# EAGLE schematic IRAMX-drv-v3.4 (EAGLE 7.7.0)
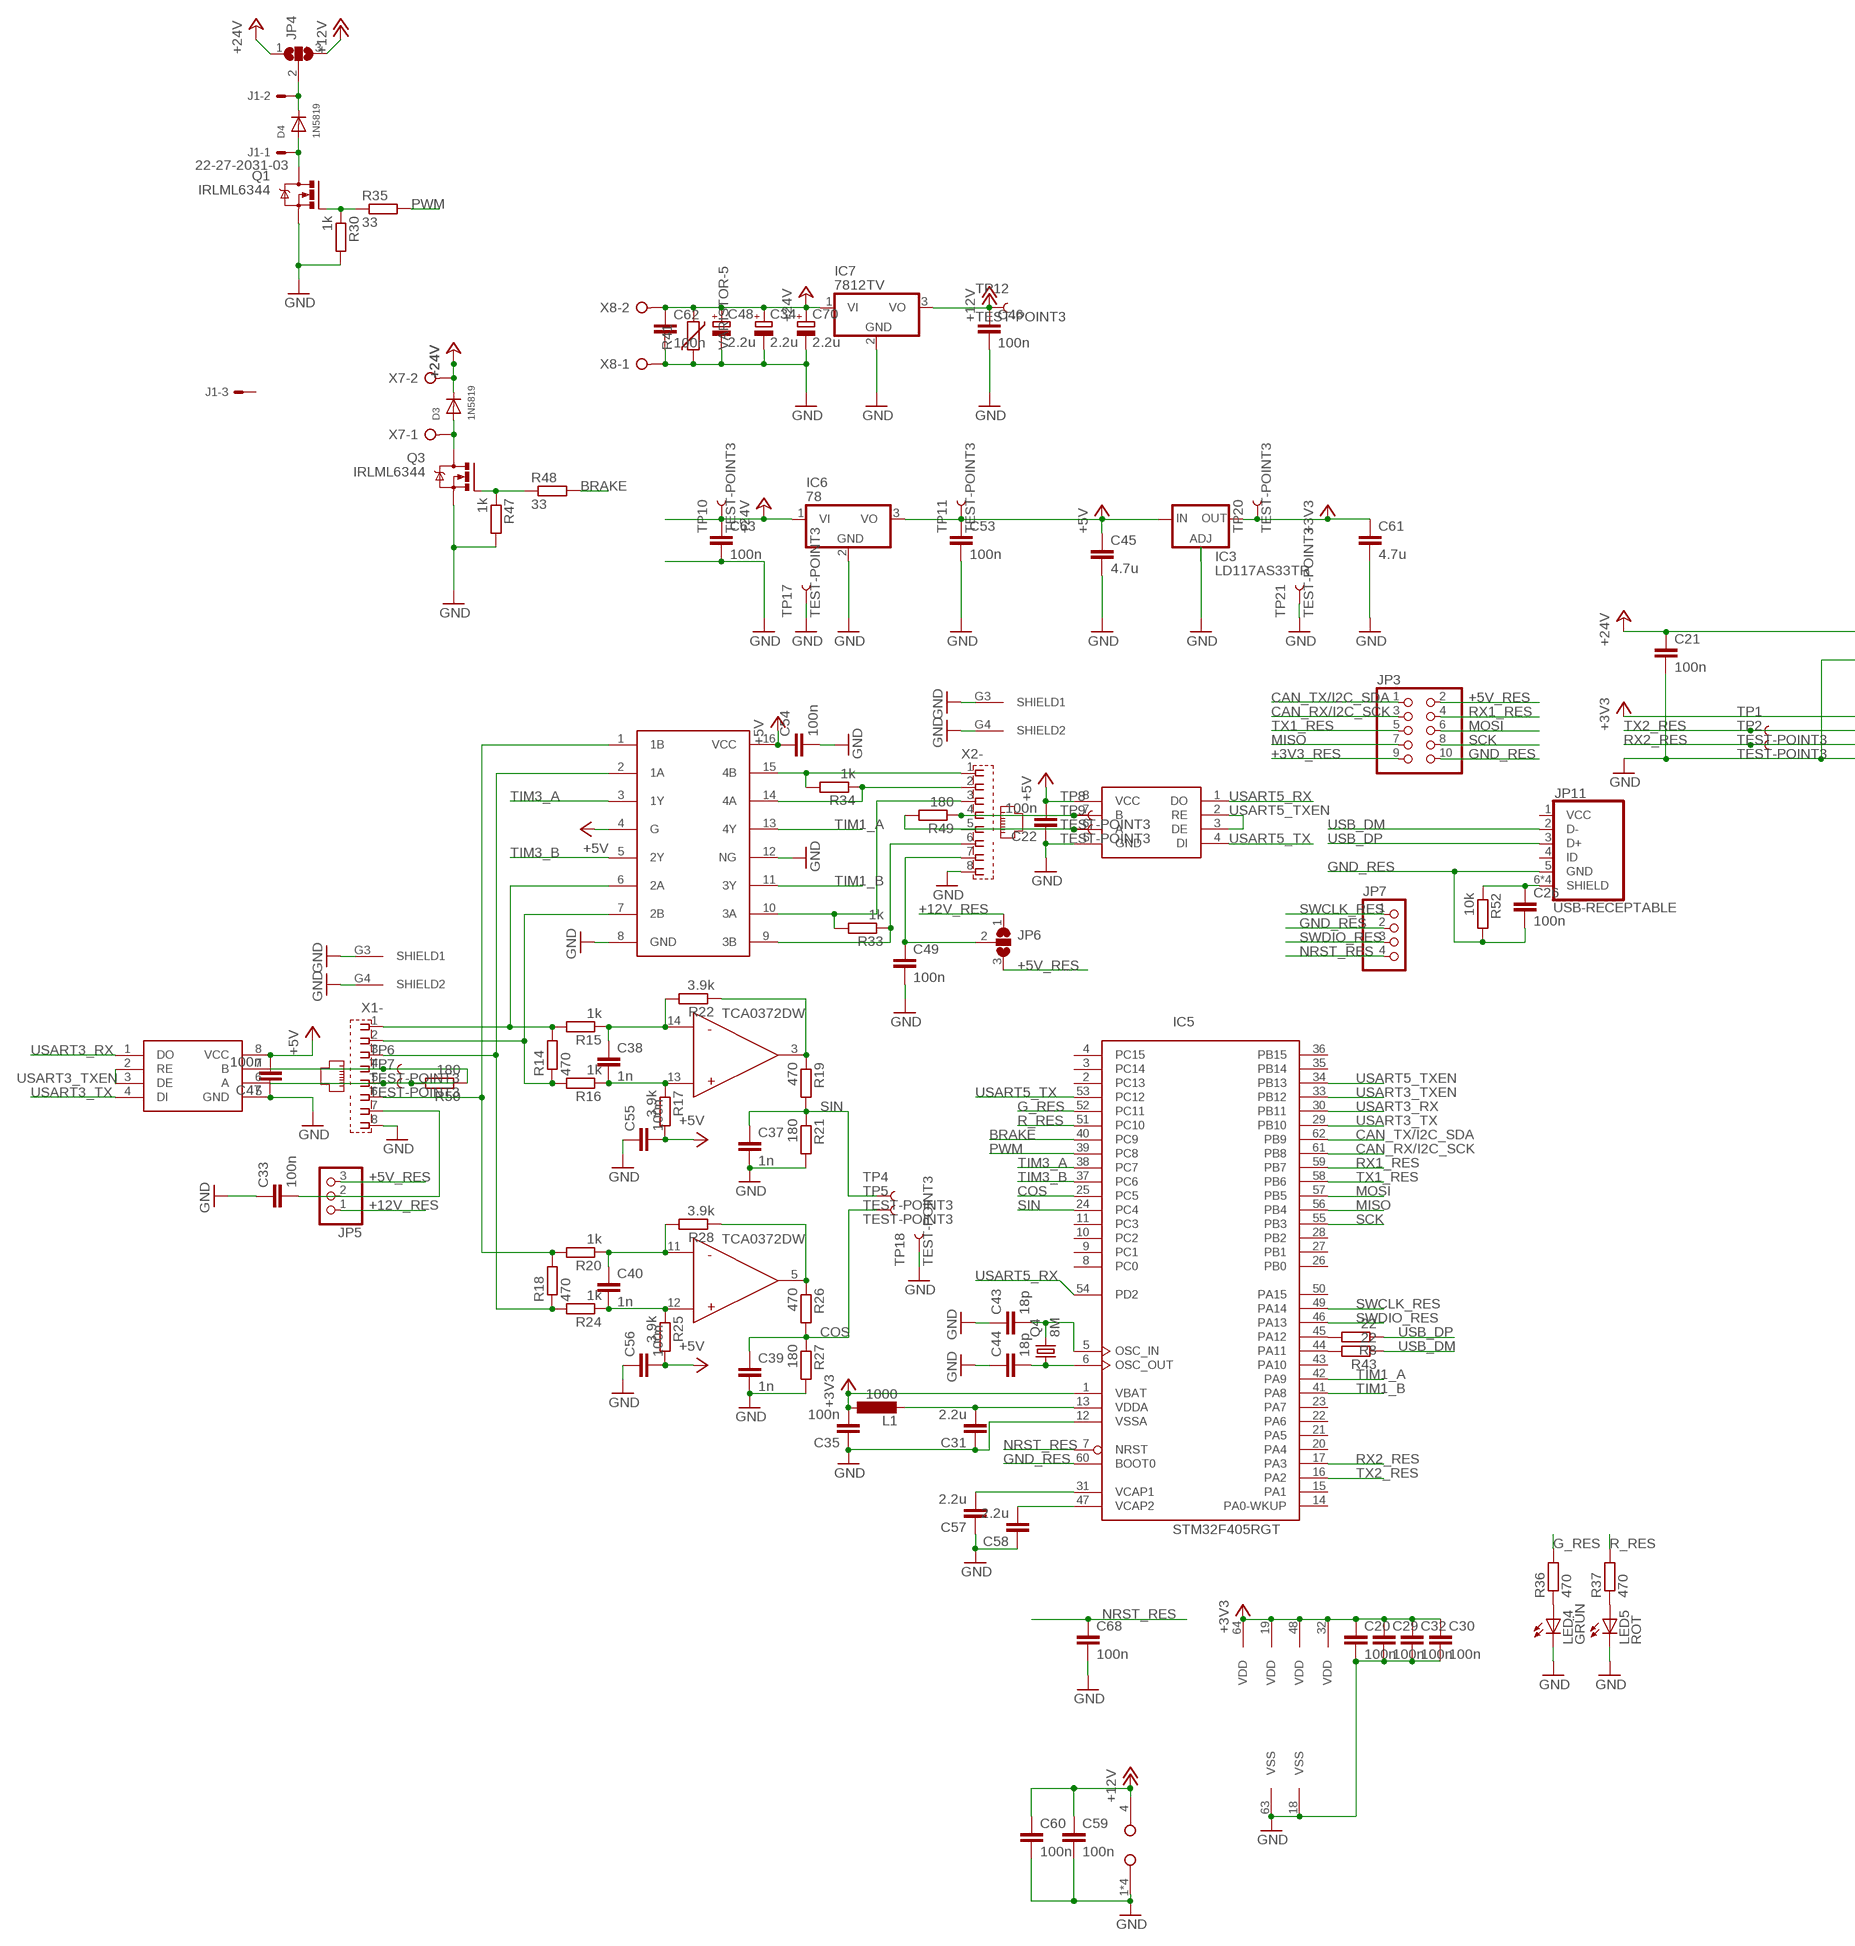
[diagram p0: schematic, sheet 1, part 1 of 2]
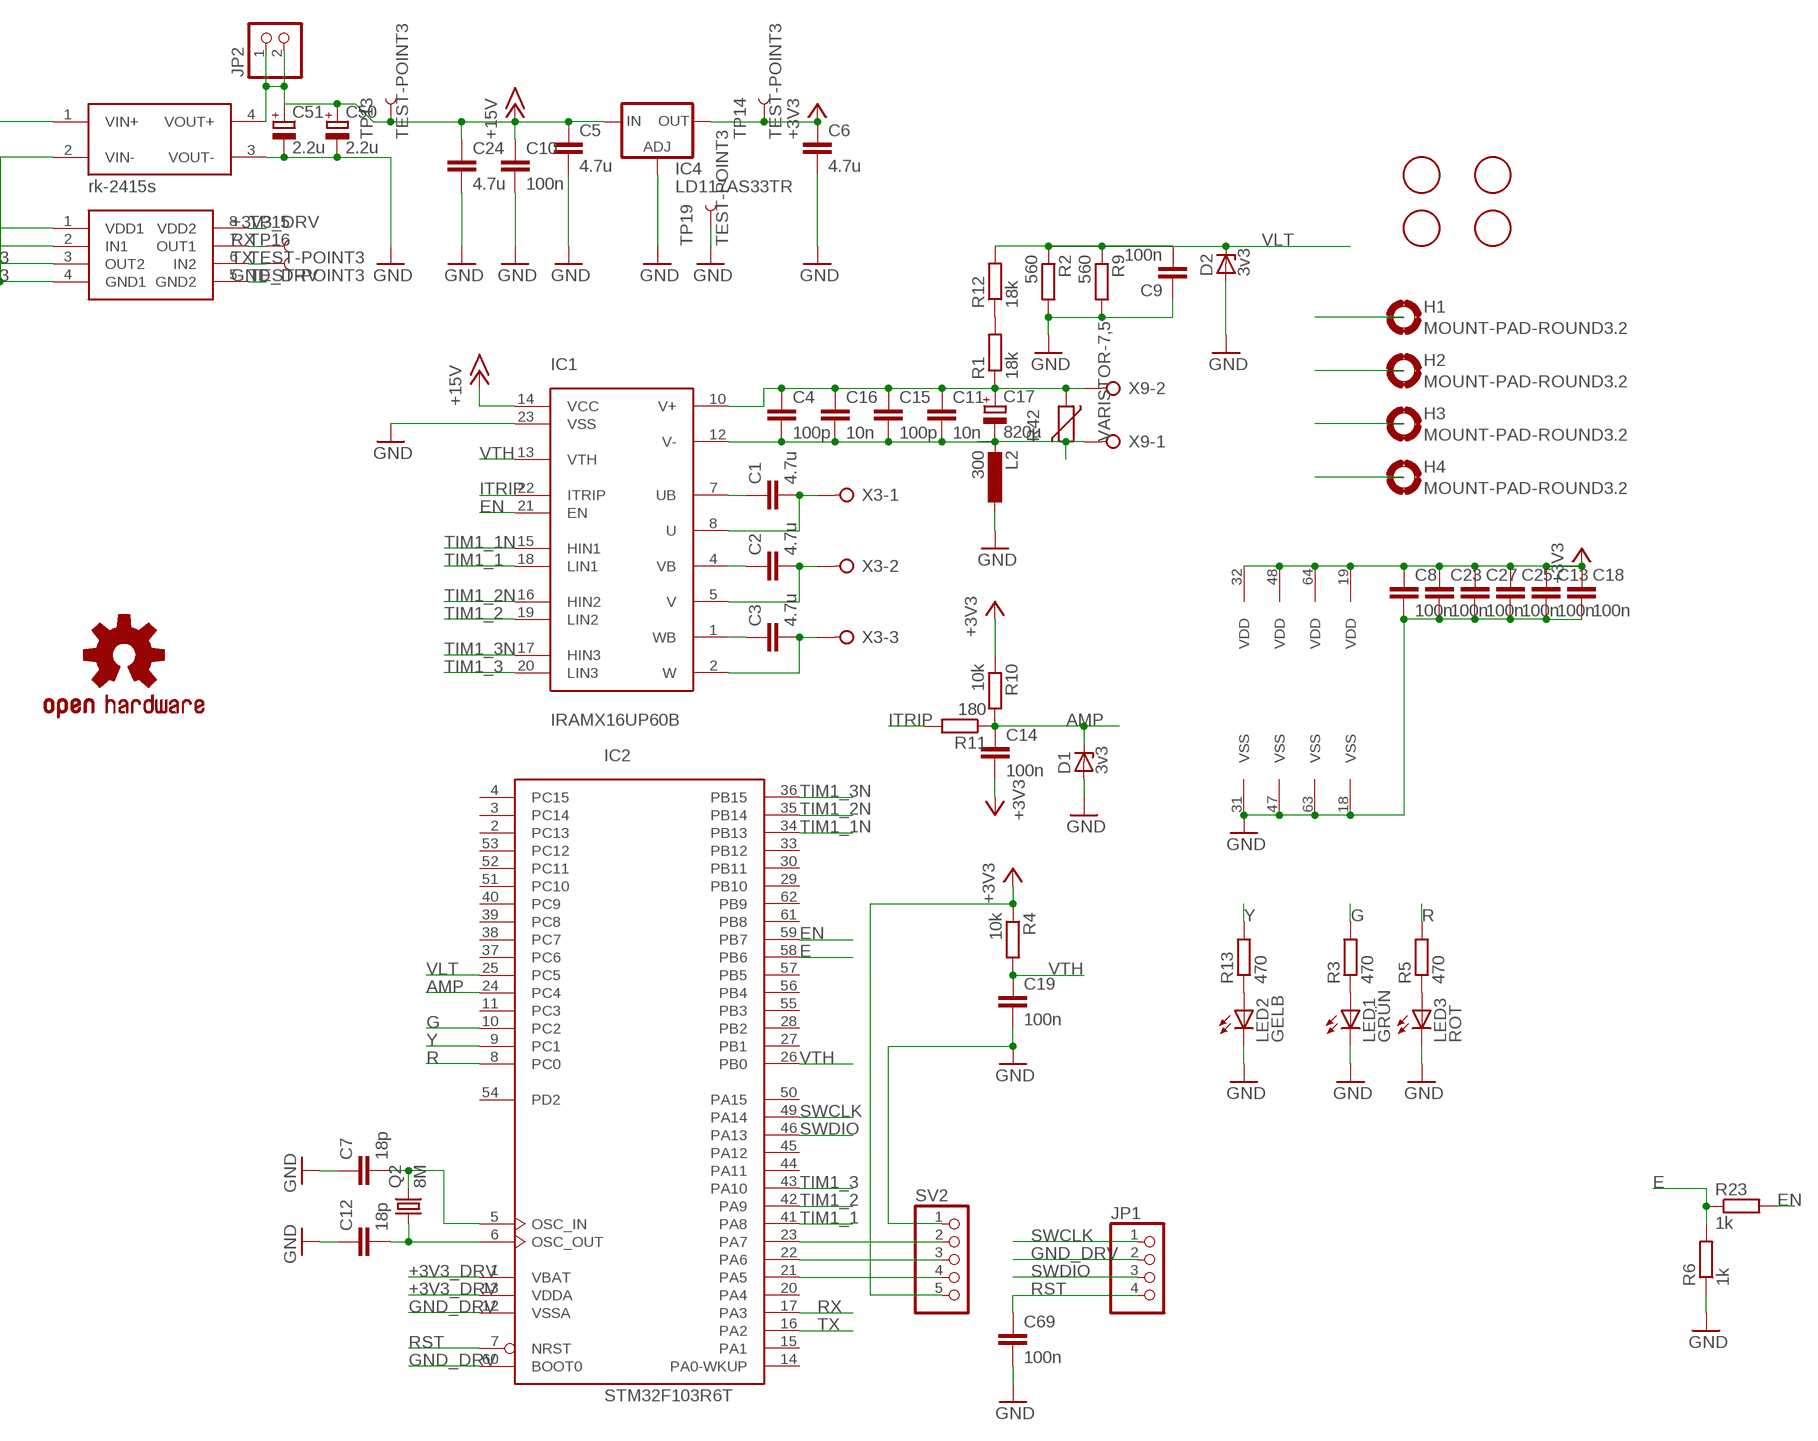
[diagram p1: schematic, sheet 1, part 2 of 2]

## Parts
C1  4.7u  C-EUC0805  [C0805]
C2  4.7u  C-EUC0805  [C0805]
C3  4.7u  C-EUC0805  [C0805]
C4  100p  C-EUC1206K  [C1206K]
C5  4.7u  C-EUC0805  [C0805]
C6  4.7u  C-EUC0805  [C0805]
C7  18p  C-EUC0603  [C0603]
C8  100n  C-EUC0603  [C0603]
C9  100n  C-EUC0603  [C0603]
C10  100n  C-EUC0603  [C0603]
C11  10n  C-EUC1206K  [C1206K]
C12  18p  C-EUC0603  [C0603]
C13  100n  C-EUC0603  [C0603]
C14  100n  C-EUC0603  [C0603]
C15  100p  C-EUC1206K  [C1206K]
C16  10n  C-EUC1206K  [C1206K]
C17  820µ  CPOL-EUE10-35  [EB35D]
C18  100n  C-EUC0603  [C0603]
C19  100n  C-EUC0603  [C0603]
C20  100n  C-EUC0603  [C0603]
C21  100n  C-EUC0603  [C0603]
C22  100n  C-EUC0603  [C0603]
C23  100n  C-EUC0603  [C0603]
C24  4.7u  C-EUC0805  [C0805]
C25  100n  C-EUC0603  [C0603]
C26  100n  C-EUC0603  [C0603]
C27  100n  C-EUC0603  [C0603]
C29  100n  C-EUC0603  [C0603]
C30  100n  C-EUC0603  [C0603]
C31  2.2u  C-EUC0603  [C0603]
C32  100n  C-EUC0603  [C0603]
C33  100n  C-EUC0603  [C0603]
C34  2.2u  CPOL-EU153CLV-0405  [153CLV-0405]
C35  100n  C-EUC0603  [C0603]
C37  1n  C-EUC0603  [C0603]
C38  1n  C-EUC0603  [C0603]
C39  1n  C-EUC0603  [C0603]
C40  1n  C-EUC0603  [C0603]
C43  18p  C-EUC0603  [C0603]
C44  18p  C-EUC0603  [C0603]
C45  4.7u  C-EUC0805  [C0805]
C46  100n  C-EUC0603  [C0603]
C47  100n  C-EUC0603  [C0603]
C48  2.2u  CPOL-EUE2,5-6E  [E2,5-6E]
C49  100n  C-EUC0603  [C0603]
C50  2.2u  CPOL-EU153CLV-0405  [153CLV-0405]
C51  2.2u  CPOL-EUE2,5-6E  [E2,5-6E]
C53  100n  C-EUC0603  [C0603]
C54  100n  C-EUC0603  [C0603]
C55  100n  C-EUC0603  [C0603]
C56  100n  C-EUC0603  [C0603]
C57  2.2u  C-EUC0603  [C0603]
C58  2.2u  C-EUC0603  [C0603]
C59  100n  C-EUC0603  [C0603]
C60  100n  C-EUC0603  [C0603]
C61  4.7u  C-EUC0805  [C0805]
C62  100n  C-EUC0603  [C0603]
C63  100n  C-EUC0603  [C0603]
C68  100n  C-EUC0603  [C0603]
C69  100n  C-EUC0603  [C0603]
C70  2.2u  CPOL-EU153CLV-0405  [153CLV-0405]
D1  3v3  ZENER-DIODESOD80C  [SOD80C]
D2  3v3  ZENER-DIODESOD80C  [SOD80C]
D3  1N5819  DIODESOD-123  [SOD-123]
D4  1N5819  DIODESOD-123  [SOD-123]
H1  MOUNT-PAD-ROUND3.2  [3,2-PAD]
H2  MOUNT-PAD-ROUND3.2  [3,2-PAD]
H3  MOUNT-PAD-ROUND3.2  [3,2-PAD]
H4  MOUNT-PAD-ROUND3.2  [3,2-PAD]
IC1  IRAMX16UP60B  IRAMTOP  [SIP23_TOP]
IC2  STM32F103R6T  [LQFP64]
IC3  LD117AS33TR  [SOT223]
IC4  LD117AS33TR  [SOT223]
IC5  STM32F405RGT  [LQFP64]
IC6  78  [R-78E]
IC7  7812TV  [TO220V]
IC8  ADM485SOIC8  [SOIC08]
IC9  ADM485SOIC8  [SOIC08]
IC10  TCA0372DWDM2  [TCA0372DM2]
IC12  SI8621  [SOIC08]
IC13  AM26LS32ACD  [SO16]
IC14  rk-2415s  RO-XXXXRK  [SIP7]
J1  22-27-2031-03  [6410-03]
JP1  PINHD-1X4  [1X04]
JP2  PINHD-1X2  [1X02]
JP3  PINHD-2X5  [2X05]
JP4  SJ2W  [SJ_2]
JP5  PINHD-1X3  [1X03]
JP6  SJ2W  [SJ_2]
JP7  PINHD-1X4  [1X04]
JP11  USB-RECEPTABLE  [FCI-10103594-0001LF]
L1  1000  L-EUL2825P  [L2825P]
L2  300  L-EUL2825P  [L2825P]
LED1  GRÜN  LED3MM  [LED3MM]
LED2  GELB  LED3MM  [LED3MM]
LED3  ROT  LED3MM  [LED3MM]
LED4  GRÜN  LED3MM  [LED3MM]
LED5  ROT  LED3MM  [LED3MM]
LOGO1  OSHW-LOGOL  [OSHW-LOGO-L]
Q1  IRLML6344  [MICRO3]
Q2  8M  CRYSTALCTS406  [CTS406]
Q3  IRLML6344  [MICRO3]
Q4  8M  CRYSTALCTS406  [CTS406]
R1  18k  R-EU_  [CER]
R2  560  R-EU_R0805  [R0805]
R3  470  R-EU_R0603  [R0603]
R4  10k  R-EU_R0603  [R0603]
R5  470  R-EU_R0603  [R0603]
R6  1k  R-EU_R0603  [R0603]
R8  22  R-EU_R0603  [R0603]
R9  560  R-EU_R0805  [R0805]
R10  10k  R-EU_R0603  [R0603]
R11  180  R-EU_R0603  [R0603]
R12  18k  R-EU_  [CER]
R13  470  R-EU_R0603  [R0603]
R14  470  R-EU_R0603  [R0603]
R15  1k  R-EU_R0603  [R0603]
R16  1k  R-EU_R0603  [R0603]
R17  3.9k  R-EU_R0603  [R0603]
R18  470  R-EU_R0603  [R0603]
R19  470  R-EU_R0603  [R0603]
R20  1k  R-EU_R0603  [R0603]
R21  180  R-EU_R0603  [R0603]
R22  3.9k  R-EU_R0603  [R0603]
R23  1k  R-EU_R0603  [R0603]
R24  1k  R-EU_R0603  [R0603]
R25  3.9k  R-EU_R0603  [R0603]
R26  470  R-EU_R0603  [R0603]
R27  180  R-EU_R0603  [R0603]
R28  3.9k  R-EU_R0603  [R0603]
R30  1k  R-EU_R0603  [R0603]
R33  1k  R-EU_R0603  [R0603]
R34  1k  R-EU_R0603  [R0603]
R35  33  R-EU_R0603  [R0603]
R36  470  R-EU_R0603  [R0603]
R37  470  R-EU_R0603  [R0603]
R41  VARISTOR-5  [R-5]
R42  VARISTOR-7,5  [R-7,5]
R43  22  R-EU_R0603  [R0603]
R47  1k  R-EU_R0603  [R0603]
R48  33  R-EU_R0603  [R0603]
R49  180  R-EU_R0603  [R0603]
R50  180  R-EU_R0603  [R0603]
R52  10k  R-EU_R0603  [R0603]
SV2  PINHD-1X5  [1X05]
TP1  TEST-POINT3  [PAD.03X.03]
TP2  TEST-POINT3  [PAD.03X.03]
TP4  TEST-POINT3  [PAD.03X.03]
TP5  TEST-POINT3  [PAD.03X.03]
TP6  TEST-POINT3  [PAD.03X.03]
TP7  TEST-POINT3  [PAD.03X.03]
TP8  TEST-POINT3  [PAD.03X.03]
TP9  TEST-POINT3  [PAD.03X.03]
TP10  TEST-POINT3  [PAD.03X.03]
TP11  TEST-POINT3  [PAD.03X.03]
TP12  TEST-POINT3  [PAD.03X.03]
TP13  TEST-POINT3  [PAD.03X.03]
TP14  TEST-POINT3  [PAD.03X.03]
TP15  TEST-POINT3  [PAD.03X.03]
TP16  TEST-POINT3  [PAD.03X.03]
TP17  TEST-POINT3  [PAD.03X.03]
TP18  TEST-POINT3  [PAD.03X.03]
TP19  TEST-POINT3  [PAD.03X.03]
TP20  TEST-POINT3  [PAD.03X.03]
TP21  TEST-POINT3  [PAD.03X.03]
U$8  FIDUCIAL  [FIDUCIAL_1MM]
U$9  FIDUCIAL  [FIDUCIAL_1MM]
U$10  FIDUCIAL  [FIDUCIAL_1MM]
U$11  FIDUCIAL  [FIDUCIAL_1MM]
X1  RJ45  [RJ45]
X2  RJ45  [RJ45]
X3  AKL230-03  [AKL230-03]
X7  AKL230-02  [AKL230-02]
X8  AKL230-02  [AKL230-02]
X9  AKL230-02  [AKL230-02]

## Nets
+3V3_DRV: C6.1 C8.1 C13.1 C14.2 C18.1 C23.1 C25.1 C27.1 IC2.1(VBAT) IC2.13(VDDA) IC2.19(VDD) IC2.32(VDD) IC2.48(VDD) IC2.64(VDD) IC4.2(OUT) IC4.4(OUT) IC12.8(VDD2) R4.1 R10.1 SV2.5 TP14.P$1 ; supply symbol labelled +3V3
+3V3_RES: C20.1 C29.1 C30.1 C32.1 C35.2 C61.1 IC3.2(OUT) IC3.4(OUT) IC5.1(VBAT) IC5.19(VDD) IC5.32(VDD) IC5.48(VDD) IC5.64(VDD) IC12.1(VDD1) JP3.9 L1.1 TP20.P$1 ; supply symbol labelled +3V3
+5V_RES: C22.2 C45.1 C47.2 C53.1 C54.1 C55.2 C56.2 IC3.3(IN) IC6.3(VO) IC8.8(VCC) IC9.8(VCC) IC13.4(G) IC13.16(VCC) JP3.2 JP5.3 JP6.3 R17.2 R25.2 TP11.P$1 ; supply symbol labelled +5V
+12V_RES: C46.1 C59.1 C60.1 IC7.3(VO) IC10.4(VCC) JP4.3 JP5.1 JP6.1 TP12.P$1 ; supply symbol labelled +12V
+15V_DRV: C5.1 C10.1 C24.1 C50.+ C51.+ IC1.14(VCC) IC4.3(IN) IC14.4(VOUT+) JP2.1 JP2.2 TP13.P$1 ; supply symbol labelled +15V
+24V_RES: C21.1 C34.+ C48.+ C62.1 C63.1 C70.+ D3.C IC6.1(VI) IC7.1(VI) IC14.1(VIN+) JP4.1 R41.1 TP10.P$1 X7.2 X8.2 ; supply symbol labelled +24V
AMP: C14.1 D1.C IC2.24(PC4) R10.2 R11.1
BRAKE: IC5.40(PC9) R48.2
CAN_RX/I2C_SCK: IC5.61(PB8) JP3.3
CAN_TX/I2C_SDA: IC5.62(PB9) JP3.1
COS: C39.1 IC5.25(PC5) R26.2 R27.1 TP5.P$1
E: IC2.58(PB6) R6.2 R23.1
EN: IC1.21(EN) IC2.59(PB7) R23.2
G: IC2.10(PC2) R3.2
G_RES: IC5.52(PC11) R36.2
GND_DRV: C5.2 C6.2 C7.1 C8.2 C9.1 C10.2 C12.1 C13.2 C18.2 C19.2 C23.2 C24.2 C25.2 C27.2 C50.- C51.- C69.2 D1.A D2.A IC1.23(VSS) IC2.12(VSSA) IC2.18(VSS) IC2.31(VSS) IC2.47(VSS) IC2.60(BOOT0) IC2.63(VSS) IC4.1(ADJ) IC12.5(GND2) IC14.3(VOUT-) JP1.2 L2.1 LED1.K(C) LED2.K(C) LED3.K(C) R2.2 R6.1 R9.2 SV2.1 TP19.P$1 ; supply symbol labelled GND
GND_RES: C20.2 C21.2 C22.1 C26.2 C29.2 C30.2 C31.1 C32.2 C33.1 C34.- C35.1 C37.2 C39.2 C43.1 C44.1 C45.2 C46.2 C47.1 C48.- C49.2 C53.2 C54.2 C55.1 C56.1 C57.1 C58.1 C59.2 C60.2 C61.2 C62.2 C63.2 C68.2 C70.- IC3.1(ADJ) IC5.12(VSSA) IC5.18(VSS) IC5.60(BOOT0) IC5.63(VSS) IC6.2(GND) IC7.2(GND) IC8.5(GND) IC9.5(GND) IC10.1(GND) IC10.8(GND) IC10.9(GND) IC10.16(GND) IC12.4(GND1) IC13.8(GND) IC13.12(NG) IC14.2(VIN-) JP3.10 JP7.2 JP11.5(GND) LED4.K(C) LED5.K(C) Q1.2(S) Q3.2(S) R21.2 R27.2 R30.2 R41.2 R47.2 R52.2 TP17.P$1 TP18.P$1 TP21.P$1 X1.8 X1.G3(SHIELD1) X1.G4(SHIELD2) X2.8 X2.G3(SHIELD1) X2.G4(SHIELD2) X8.1 ; supply symbol labelled GND
ITRIP: IC1.22(ITRIP) R11.2
MISO: IC5.56(PB4) JP3.7
MOSI: IC5.57(PB5) JP3.6
N$1 [iso]: C1.1 IC1.7(UB)
N$2 [iso]: R1.P$2 R12.P$1
N$3 [iso]: C2.1 IC1.4(VB)
N$5 [iso]: C3.1 IC1.1(WB)
N$8: LED1.A R3.1
N$9: LED3.A R5.1
N$10: C7.2 IC2.5(OSC_IN) Q2.3
N$11: LED4.A R36.1
N$12: C12.2 IC2.6(OSC_OUT) Q2.1
N$16: C33.2 JP5.2 X1.7
N$18: IC10.3(OUT) R19.1 R22.1
N$19: C38.2 IC10.13(IN+) R16.1 R17.1
N$20: LED5.A R37.1
N$24: C40.2 IC10.12(IN+) R24.1 R25.1
N$25: C49.1 JP6.2 X2.7
N$26: IC10.5(OUT) R26.1 R28.1
N$27: IC9.7(B) R50.1 TP6.P$1 X1.4
N$28: C40.1 IC10.11(IN-) R20.1 R28.2
N$29: IC13.15(4B) R34.2 X2.1
N$32: C38.1 IC10.14(IN-) R15.1 R22.2
N$34: IC9.6(A) R50.2 TP7.P$1 X1.5
N$36: IC13.14(4A) R34.1 X2.2
N$37: IC13.10(3A) R33.2 X2.3
N$38: IC13.9(3B) R33.1 X2.6
N$40: IC13.1(1B) R18.2 R20.2 X1.6
N$41: IC13.7(2B) R14.1 R16.2 X1.2
N$42: D4.A J1.1 Q1.3(D)
N$43: LED2.A R13.1
N$44: Q1.1(G) R30.1 R35.1
N$47: IC13.6(2A) R14.2 R15.2 X1.1
N$50: IC13.2(1A) R18.1 R24.2 X1.3
N$52: D4.C J1.2 JP4.2
N$57: IC8.6(A) R49.2 TP9.P$1 X2.5
N$58: IC8.7(B) R49.1 TP8.P$1 X2.4
N$61: D3.A Q3.3(D) X7.1
N$62: Q3.1(G) R47.1 R48.1
NRST_RES: C68.1 IC5.7(NRST) JP7.4
OSC_IN: C43.2 IC5.5(OSC_IN) Q4.3
OSC_OUT: C44.2 IC5.6(OSC_OUT) Q4.1
PA5: IC2.21(PA5) SV2.4
PA6: IC2.22(PA6) SV2.3
PA7: IC2.23(PA7) SV2.2
PWM: IC5.39(PC8) R35.2
R: IC2.8(PC0) R5.2
R_RES: IC5.51(PC10) R37.2
RST: C69.1 IC2.7(NRST) JP1.4
RX: IC2.17(PA3) IC12.7(OUT1) TP15.P$1
RX1_RES: IC5.59(PB7) JP3.4
RX2_RES: IC5.17(PA3) IC12.3(OUT2) TP2.P$1
SCK: IC5.55(PB3) JP3.8
SIN: C37.1 IC5.24(PC4) R19.2 R21.1 TP4.P$1
SWCLK: IC2.49(PA14) JP1.1
SWCLK_RES: IC5.49(PA14) JP7.1
SWDIO: IC2.46(PA13) JP1.3
SWDIO_RES: IC5.46(PA13) JP7.3
TIM1_1: IC1.18(LIN1) IC2.41(PA8)
TIM1_1N: IC1.15(HIN1) IC2.34(PB13)
TIM1_2: IC1.19(LIN2) IC2.42(PA9)
TIM1_2N: IC1.16(HIN2) IC2.35(PB14)
TIM1_3: IC1.20(LIN3) IC2.43(PA10)
TIM1_3N: IC1.17(HIN3) IC2.36(PB15)
TIM1_A: IC5.42(PA9) IC13.13(4Y)
TIM1_B: IC5.41(PA8) IC13.11(3Y)
TIM3_A: IC5.38(PC7) IC13.3(1Y)
TIM3_B: IC5.37(PC6) IC13.5(2Y)
TX: IC2.16(PA2) IC12.6(IN2) TP16.P$1
TX1_RES: IC5.58(PB6) JP3.5
TX2_RES: IC5.16(PA2) IC12.2(IN1) TP1.P$1
U [dick]: C1.2 IC1.8(U) X3.1
USART3_RX: IC5.30(PB11) IC9.1(DO)
USART3_TX: IC5.29(PB10) IC9.4(DI)
USART3_TXEN: IC5.33(PB12) IC9.2(RE) IC9.3(DE)
USART5_RX: IC5.54(PD2) IC8.1(DO)
USART5_TX: IC5.53(PC12) IC8.4(DI)
USART5_TXEN: IC5.34(PB13) IC8.2(RE) IC8.3(DE)
USB_DM: JP11.2(D-) R43.1
USB_DM_: IC5.44(PA11) R43.2
USB_DP: JP11.3(D+) R8.1
USB_DP_: IC5.45(PA12) R8.2
USB_SHIELD: C26.1 JP11.6(SHIELD) JP11.7(SHIELD) JP11.8(SHIELD) JP11.9(SHIELD) R52.1
V [dick]: C2.2 IC1.5(V) X3.2
V+ [dick]: C4.1 C11.1 C15.1 C16.1 C17.+ IC1.10(V+) R1.P$1 R42.1 X9.2
V-: C4.2 C11.2 C15.2 C16.2 C17.- IC1.12(V-) L2.2 R42.2 X9.1
VCAP1: C57.2 IC5.31(VCAP1)
VCAP2: C58.2 IC5.47(VCAP2)
VDDA: C31.2 IC5.13(VDDA) L1.2
VLT: C9.2 D2.C IC2.25(PC5) R2.1 R9.1 R12.P$2
VTH: C19.1 IC1.13(VTH) IC2.26(PB0) R4.2
W [dick]: C3.2 IC1.2(W) X3.3
Y: IC2.9(PC1) R13.2
Unconnected: H1.B3,2(MOUNT) H2.B3,2(MOUNT) H3.B3,2(MOUNT) H4.B3,2(MOUNT) IC2.2(PC13) IC2.3(PC14) IC2.4(PC15) IC2.11(PC3) IC2.14(PA0-WKUP) IC2.15(PA1) IC2.20(PA4) IC2.27(PB1) IC2.28(PB2) IC2.29(PB10) IC2.30(PB11) IC2.33(PB12) IC2.37(PC6) IC2.38(PC7) IC2.39(PC8) IC2.40(PC9) IC2.44(PA11) IC2.45(PA12) IC2.50(PA15) IC2.51(PC10) IC2.52(PC11) IC2.53(PC12) IC2.54(PD2) IC2.55(PB3) IC2.56(PB4) IC2.57(PB5) IC2.61(PB8) IC2.62(PB9) IC5.2(PC13) IC5.3(PC14) IC5.4(PC15) IC5.8(PC0) IC5.9(PC1) IC5.10(PC2) IC5.11(PC3) IC5.14(PA0-WKUP) IC5.15(PA1) IC5.20(PA4) IC5.21(PA5) IC5.22(PA6) IC5.23(PA7) IC5.26(PB0) IC5.27(PB1) IC5.28(PB2) IC5.35(PB14) IC5.36(PB15) IC5.43(PA10) IC5.50(PA15) J1.3 JP11.1(VCC) JP11.4(ID)

## Library data of the parts
C1-C16 C18-C27 C29-C33 C35 C37-C40 C43-C47 C49 C53-C63 C68 C69 = rcl:C-EU: CAPACITOR, European symbol
C17 C34 C48 C50 C51 C70 = rcl:CPOL-EU: POLARIZED CAPACITOR, European symbol
D1 D2 = diode:ZENER-DIODE: Z-Diode
D3 D4 = adafruit:DIODE: Diode SMADIODE - SMA Surface Mount Package 20V 1A Schottky Diode Digikey: 641-1014-6-ND DO-1N4148 - Through Hole Small Current Diode SOD-123 20V 1 A (.5mV Vf) Schottky Diode - Digikey: MBRX120TPMSCT-ND SOD-323 10V 570mA (.38mV Vf, 3ns) Schottky Diode - Digikey: ZLLS410CT-ND SOD-523 30V 30mA Schottky Diode (RB751S-40TE61) - Digikey: RB751S-40TE61CT-ND SOT23-R/W - SOT23 Package (R = Solder Paste/Reflow Ovens, W = Hand-Soldering) BAT54Film 40V 300mA - Digikey: 497-7162-1-ND
H1-H4 = holes:MOUNT-PAD-ROUND: MOUNTING PAD, round
IC1 = iram-b:IRAM
IC2 = micro-stm_v2:STM32F103R*T: ARM 32-bit Cortex™-M3 CPU 72 MHz maximum frequency 16 to 1024 Kbytes of Flash memory 6 to 96 kbytes of SRAM 51 GPIOs 2.0 to 3.6 V application supply
IC3 IC4 = reroolib:LD117A?*: Low drop fixed and adjustable positive voltage regulators 1 A Source: http://www.st.com/stonline/products/literature/ds/7194/ld1117axx.pdf
IC5 = micro-stm_v2:STM32F405R*T: ARM 32-bit Cortex™-M3 CPU 168 MHz maximum frequency 1024 Kbytes of Flash memory 192 kbytes of SRAM 51 GPIOs 1.8 to 3.6 V application supply
IC6 = reroolib:78*: Positive VOLTAGE REGULATOR Source: http://cache.national.com/ds/LM/LM78L05.pdf http://www.fairchildsemi.com/ds/LM/LM7805.pdf
IC7 = linear:78*: Positive VOLTAGE REGULATOR Source: http://cache.national.com/ds/LM/LM78L05.pdf http://www.fairchildsemi.com/ds/LM/LM7805.pdf
IC8 IC9 = reroolib:ADM485
IC10 = tca0372dw:TCA0372DW
IC12 = reroolib:SI8621
IC13 = reroolib:AM26LS32
IC14 = reroolib:RO-XXXX
J1 = con-molex:22-?-03: CONNECTOR wire to board 2.54 mm (.1 inch) pitch header; OC_FARNELL: unknown; OC_NEWARK: unknown
JP1 JP7 = pinhead:PINHD-1X4: PIN HEADER
JP2 = pinhead:PINHD-1X2: PIN HEADER
JP3 = pinhead:PINHD-2X5: PIN HEADER
JP4 JP6 = jumper:SJ2W: SMD solder JUMPER
JP5 = pinhead:PINHD-1X3: PIN HEADER
JP11 = reroolib:USB-RECEPTABLE: USB Receptable
L1 L2 = resistor:L-EU: INDUCTOR, European symbol
LED1-LED5 = led:LED: LED OSRAM: - CHIPLED LG R971, LG N971, LY N971, LG Q971, LY Q971, LO R971, LY R971 LH N974, LH R974 LS Q976, LO Q976, LY Q976 LO Q996 - Hyper CHIPLED LW Q18S LB Q993, LB Q99A, LB R99A - SideLED LS A670, LO A670, LY A670, LG A670, LP A670 LB A673, LV A673, LT A673, LW A673 LH A674 LY A675 LS A676, LA A676, LO A676, LY A676, LW A676 LS A679, LY A679, LG A679 - Hyper Micro SIDELED® LS Y876, LA Y876, LO Y876, LY Y876 LT Y87S - SmartLED LW L88C, LW L88S LB L89C, LB L89S, LG L890 LS L89K, LO L89K, LY L89K LS L896, LA L896, LO L896, LY L896 - TOPLED LS T670, LO T670, LY T670, LG T670, LP T670 LSG T670, LSP T670, LSY T670, LOP T670, LYG T670 LG T671, LOG T671, LSG T671 LB T673, LV T673, LT T673, LW T673 LH T674 LS T676, LA T676, LO T676, LY T676, LB T676, LH T676, LSB T676, LW T676 LB T67C, LV T67C, LT T67C, LS T67K, LO T67K, LY T67K, LW E67C LS E67B, LA E67B, LO E67B, LY E67B, LB E67C, LV E67C, LT E67C LW T67C LS T679, LY T679, LG T679 LS T770, LO T770, LY T770, LG T770, LP T770 LB T773, LV T773, LT T773, LW T773 LH T774 LS E675, LA E675, LY E675, LS T675 LS T776, LA T776, LO T776, LY T776, LB T776 LHGB T686 LT T68C, LB T68C - Hyper Mini TOPLED® LB M676 - Mini TOPLED Santana® LG M470 LS M47K, LO M47K, LY M47K Source: http://www.osram.convergy.de LUXEON: - LUMILED® LXK2-PW12-R00, LXK2-PW12-S00, LXK2-PW14-U00, LXK2-PW14-V00 LXK2-PM12-R00, LXK2-PM12-S00, LXK2-PM14-U00 LXK2-PE12-Q00, LXK2-PE12-R00, LXK2-PE12-S00, LXK2-PE14-T00, LXK2-PE14-U00 LXK2-PB12-K00, LXK2-PB12-L00, LXK2-PB12-M00, LXK2-PB14-N00, LXK2-PB14-P00, LXK2-PB14-Q00 LXK2-PR12-L00, LXK2-PR12-M00, LXK2-PR14-Q00, LXK2-PR14-R00 LXK2-PD12-Q00, LXK2-PD12-R00, LXK2-PD12-S00 LXK2-PH12-R00, LXK2-PH12-S00 LXK2-PL12-P00, LXK2-PL12-Q00, LXK2-PL12-R00 Source: www.luxeon.com KINGBRIGHT: KA-3528ASYC Source: www.kingbright.com
LOGO1 = SparkFun-Aesthetics:OSHW-LOGO: Open Source Hardware Logo This logo indicates the piece of hardware it is found on incorporates a OSHW license and/or adheres to the definition of open source hardware found here: http://freedomdefined.org/OSHW
Q1 Q3 = reroolib:IRLML6344: N-CHANNEL MOS FET
Q2 Q4 = crystal:CRYSTAL: CRYSTAL; OC_FARNELL: unknown; OC_NEWARK: unknown
R1 R12 = reroolib:R-EU_: RESISTOR, European symbol
R2-R6 R8-R11 R13-R28 R30 R33-R37 R43 R47-R50 R52 = rcl:R-EU_: RESISTOR, European symbol
R41 R42 = varistor:VARISTOR: VARISTOR
SV2 = pinhead:PINHD-1X5: PIN HEADER
TP1 TP2 TP4-TP21 = SparkFun-Passives:TEST-POINT: Bare copper test points for troubleshooting or ICT
U$8-U$11 = adafruit:FIDUCIAL: For use by pick and place machines to calibrate the vision/machine, 1mm By microbuilder.eu
X1 X2 = reroolib:RJ45: AMP connector
X3 = reroolib:AKL230-03: WAGO SREW CLAMP; OC_FARNELL: unknown; OC_NEWARK: unknown
X7-X9 = reroolib:AKL230-02: WAGO SREW CLAMP; OC_FARNELL: unknown; OC_NEWARK: unknown

## Net classes
0 default: width 0.2 mm, drill 0.1 mm, clearance 0.19 mm
1 dick: width 3.5 mm, clearance 1 mm
2 iso: width 0.5 mm, clearance 1 mm
3 iso1: width 0.5 mm, clearance 1 mm
4 iso2: width 0.5 mm, clearance 1 mm
5 iso3: width 0.5 mm, clearance 1 mm
6 iso4: width 0.5 mm, clearance 1 mm